# EasyEDA schematic SCH_u2-SX Mini - Slot Board_2024-03-27.json

## Sheets
1 CONN: TITLE: Sheet_1; REV: 1.0; Date: 2024-03-24; Sheet: 1/1; Drawn By: Denjhang; Company: Your Company
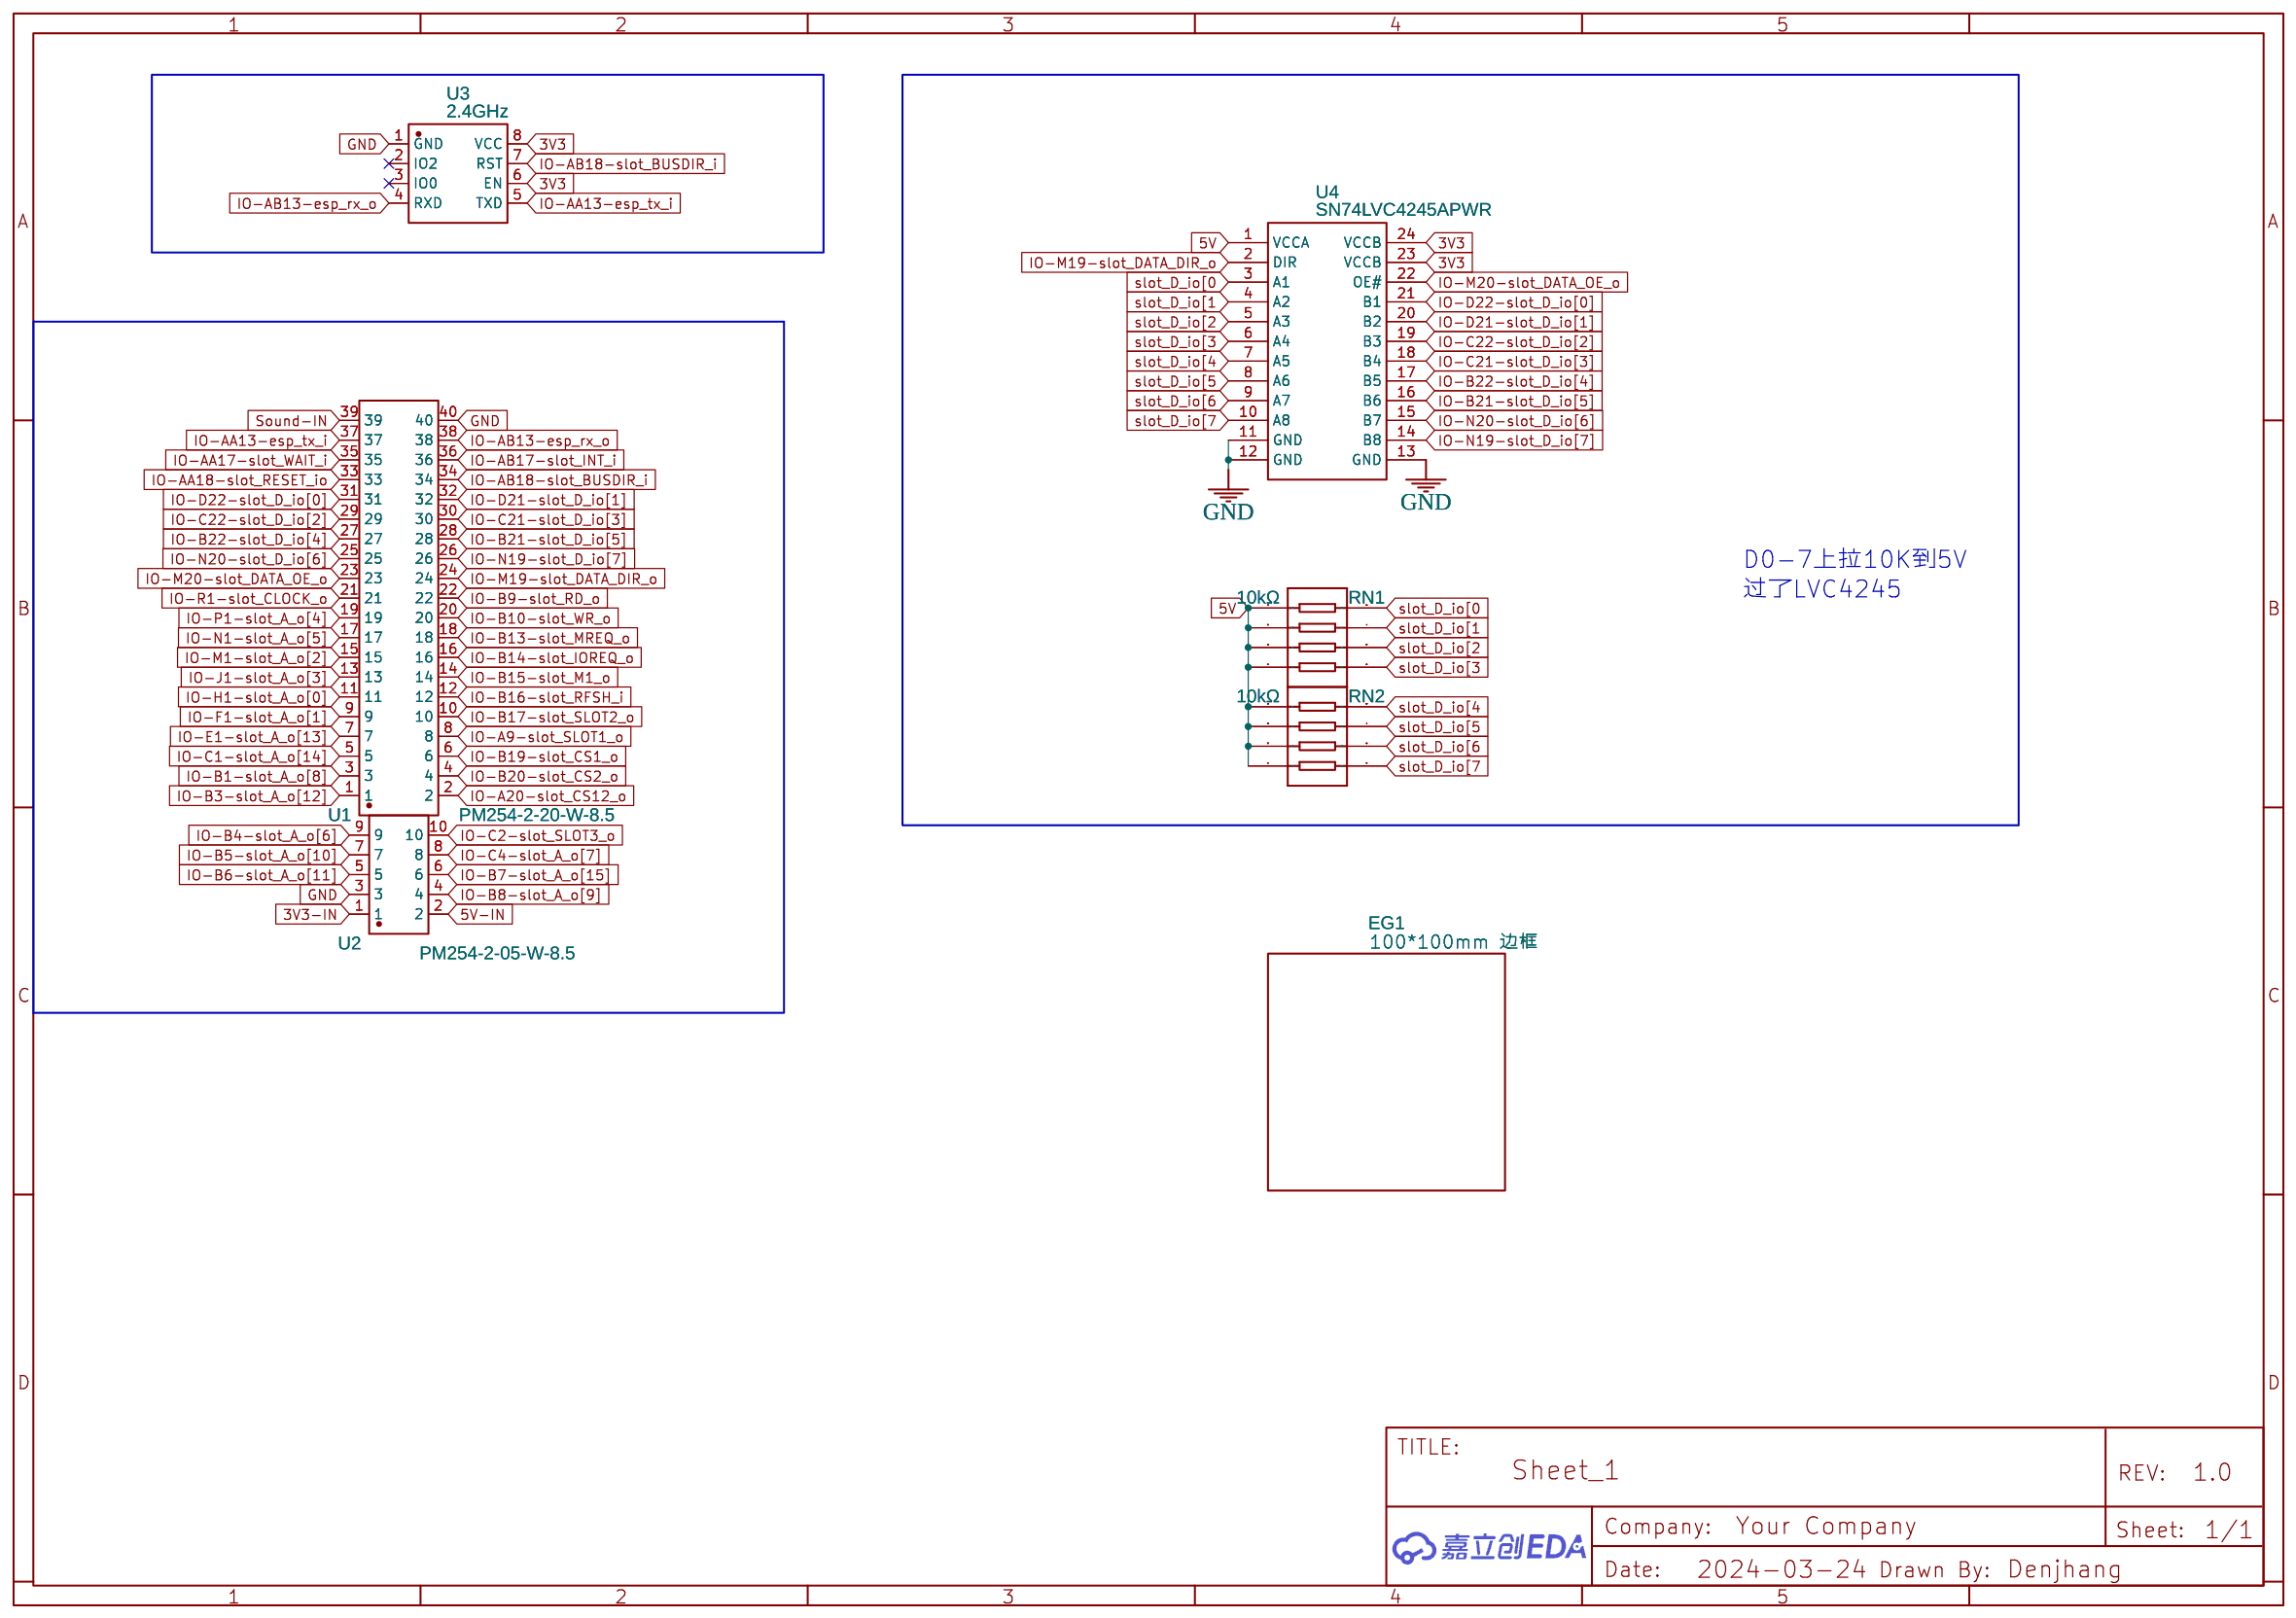
[diagram p0: CONN]
2 SLOT: TITLE: Sheet_2
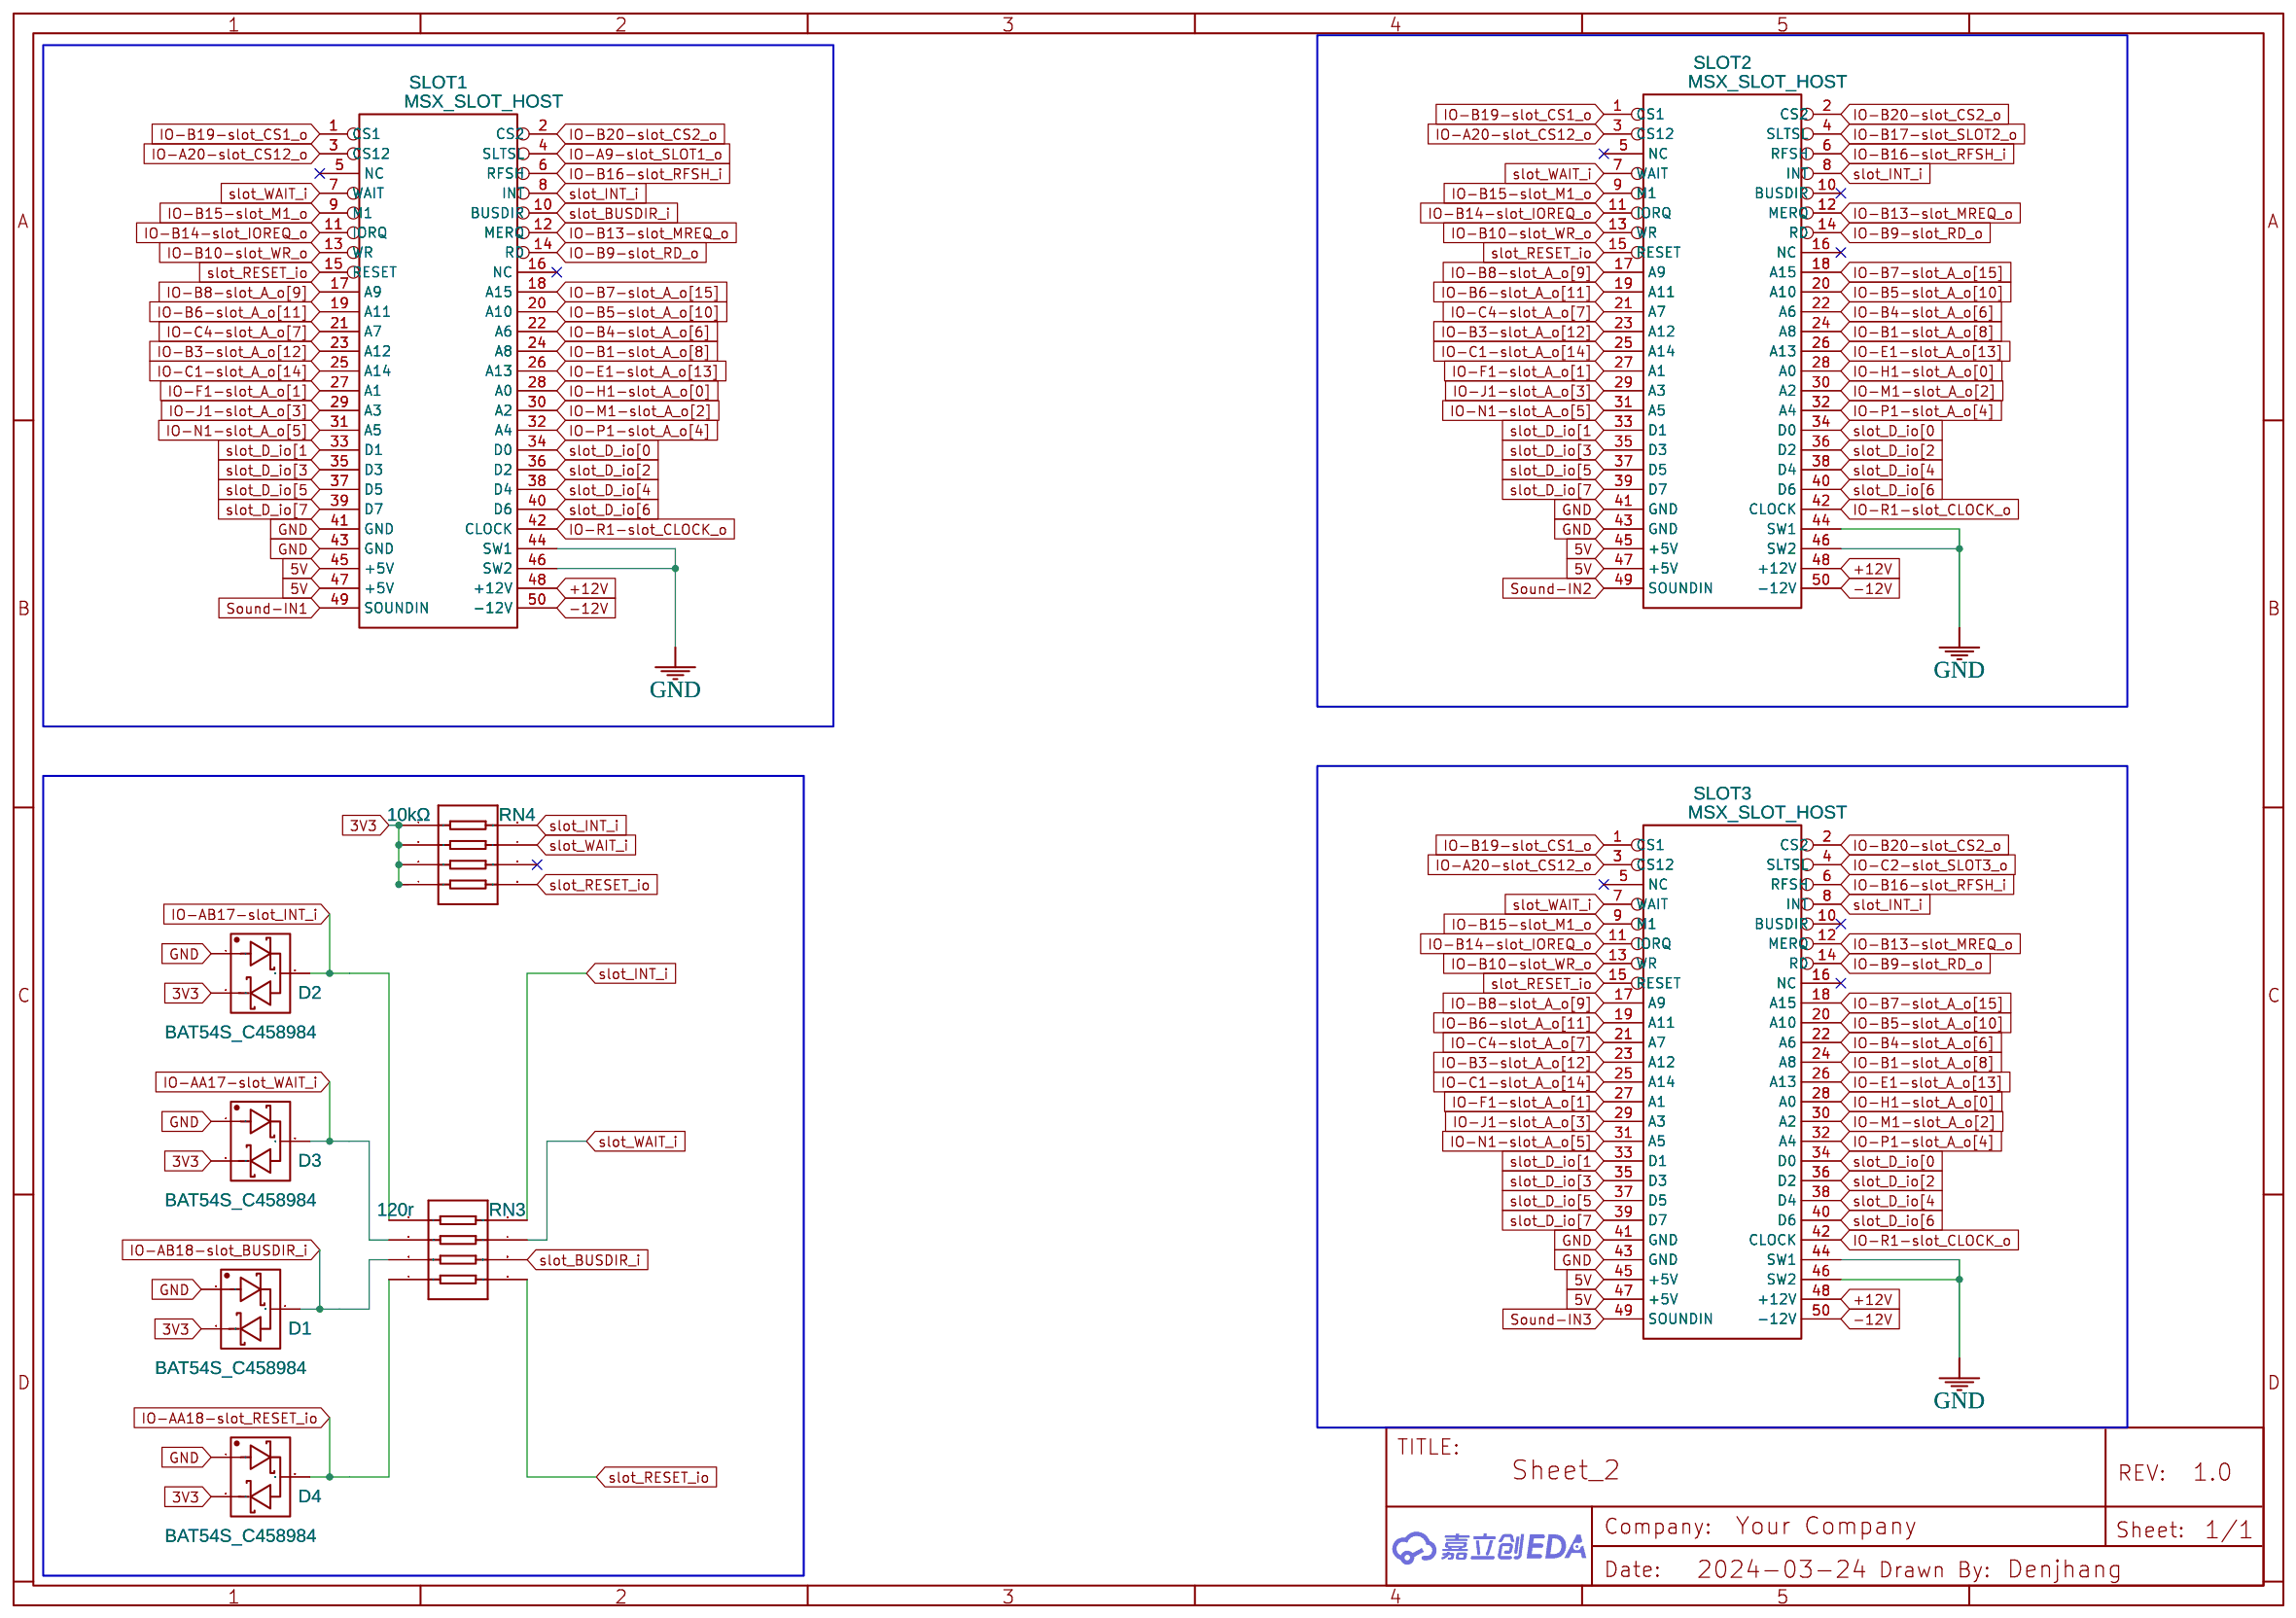
[diagram p1: SLOT]
3 PSU: TITLE: Sheet_2
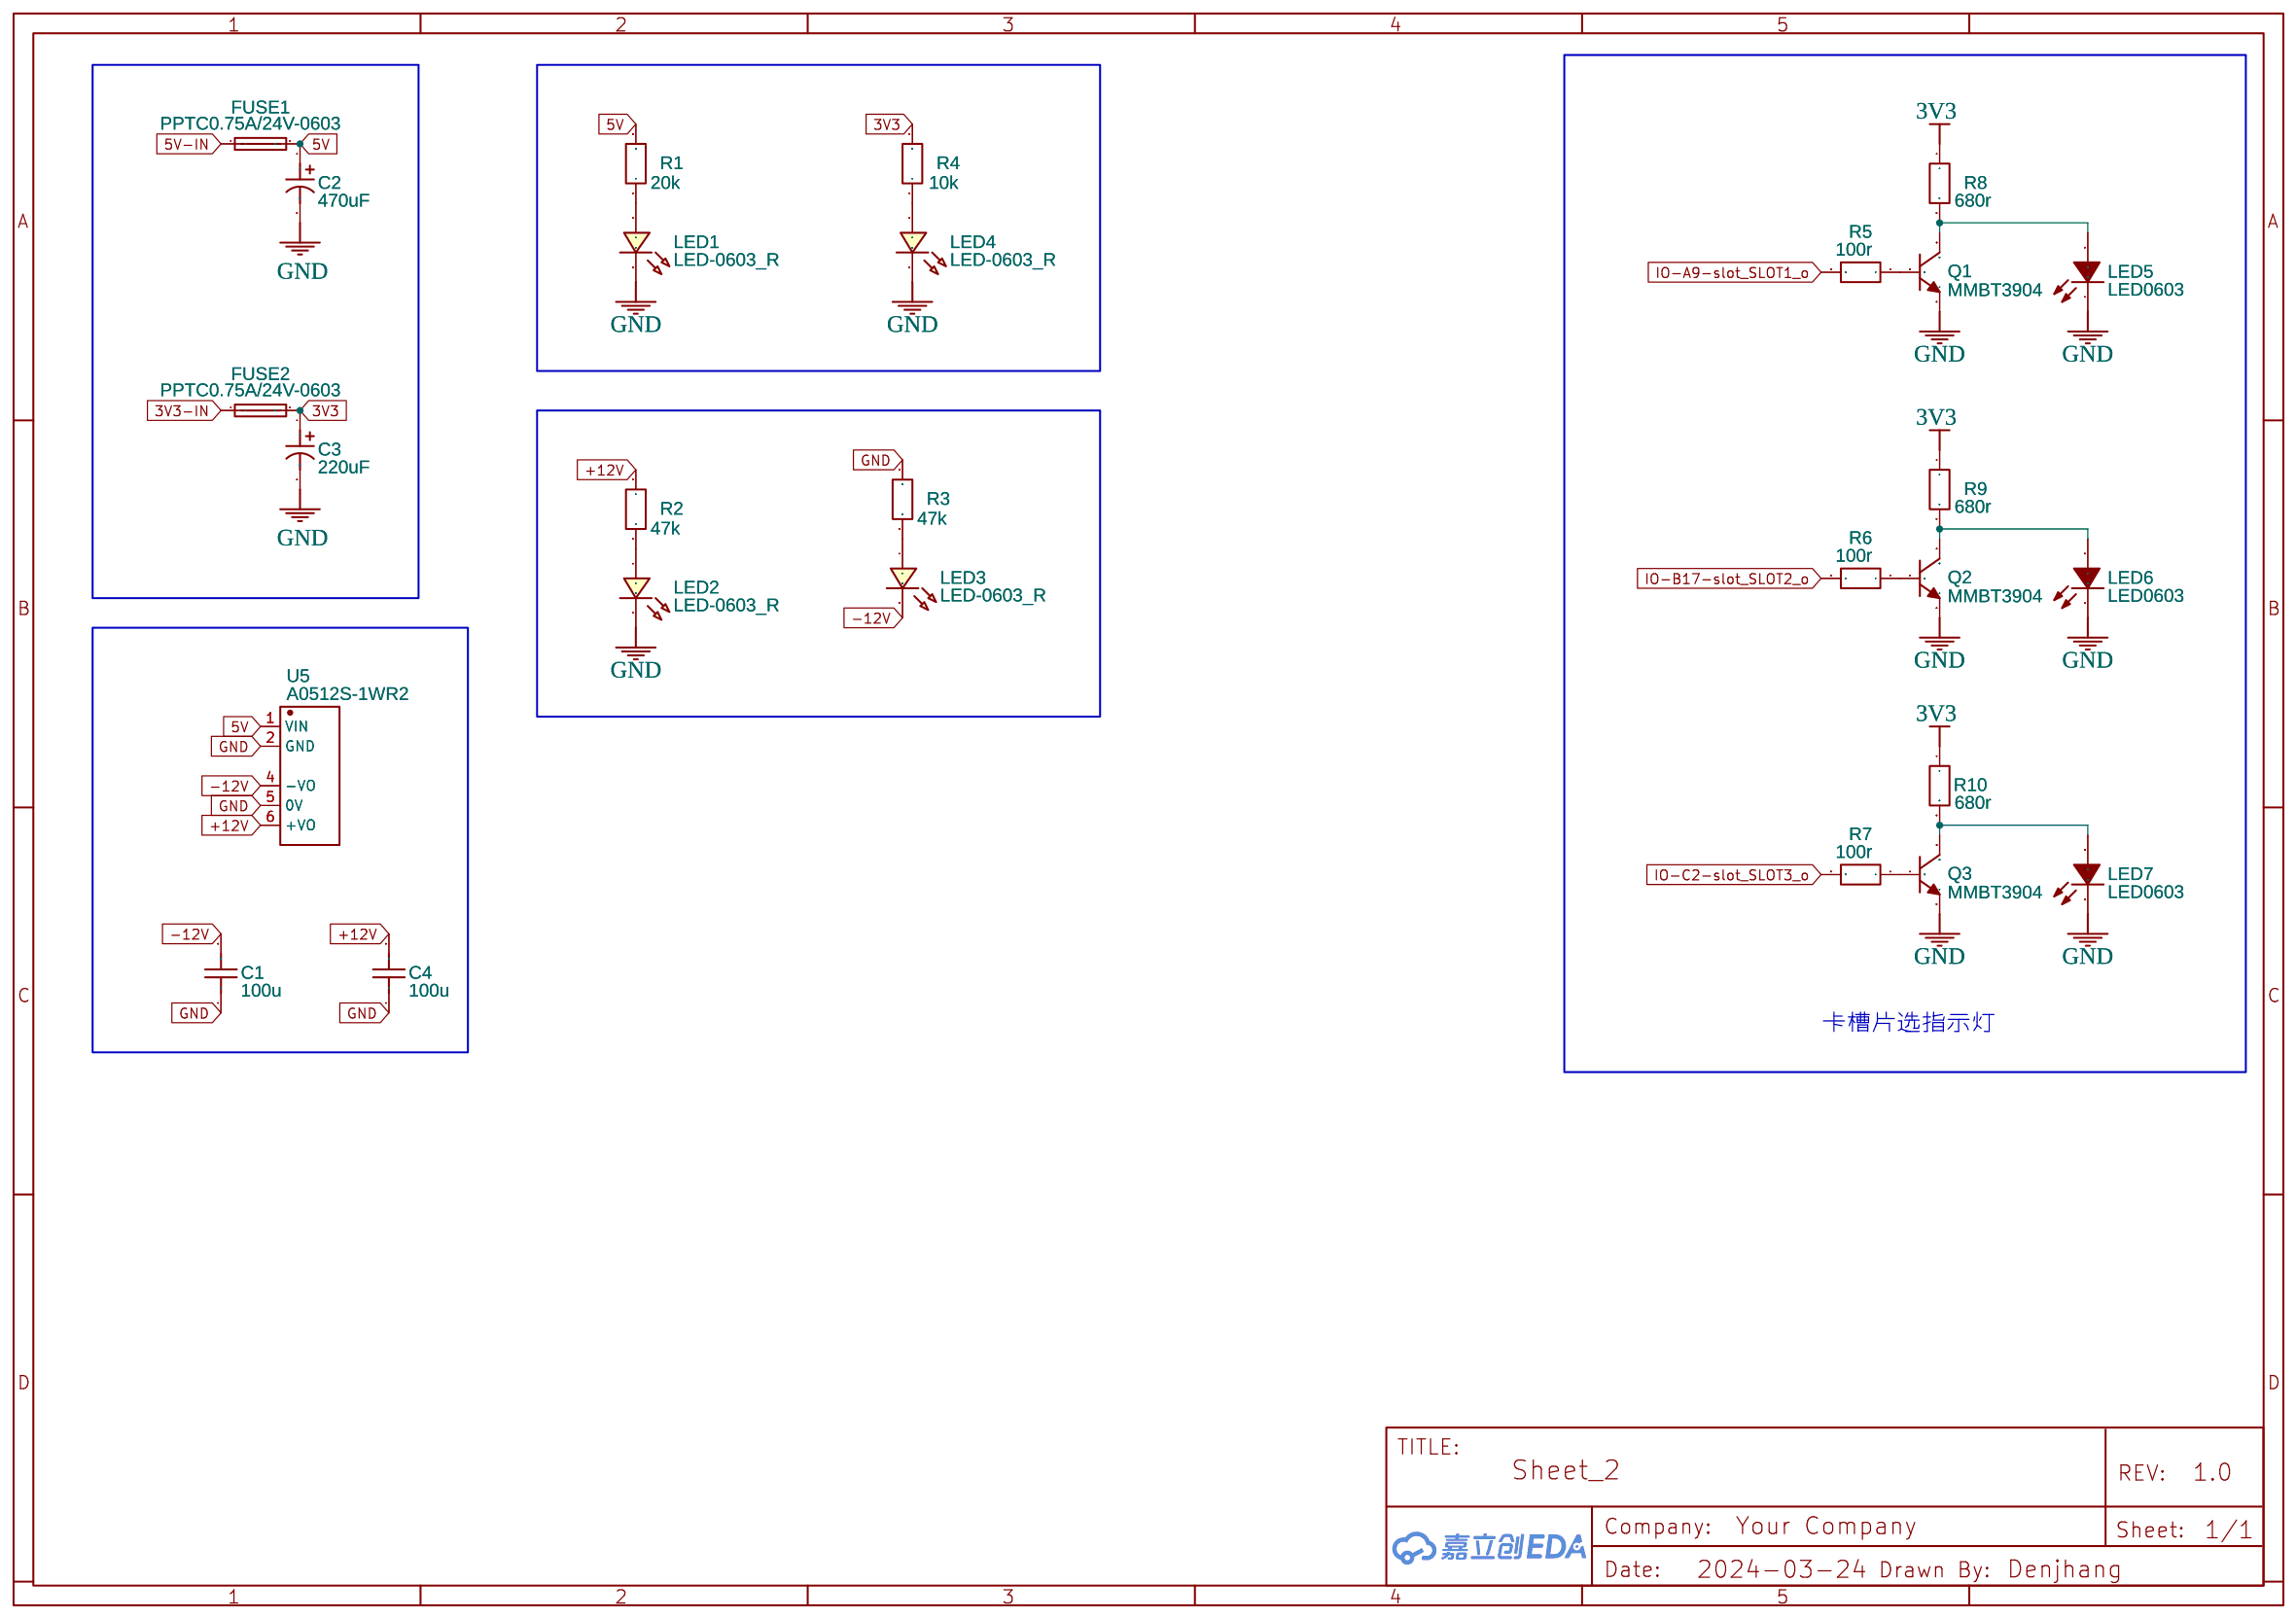
[diagram p2: PSU]
4 AUDIO
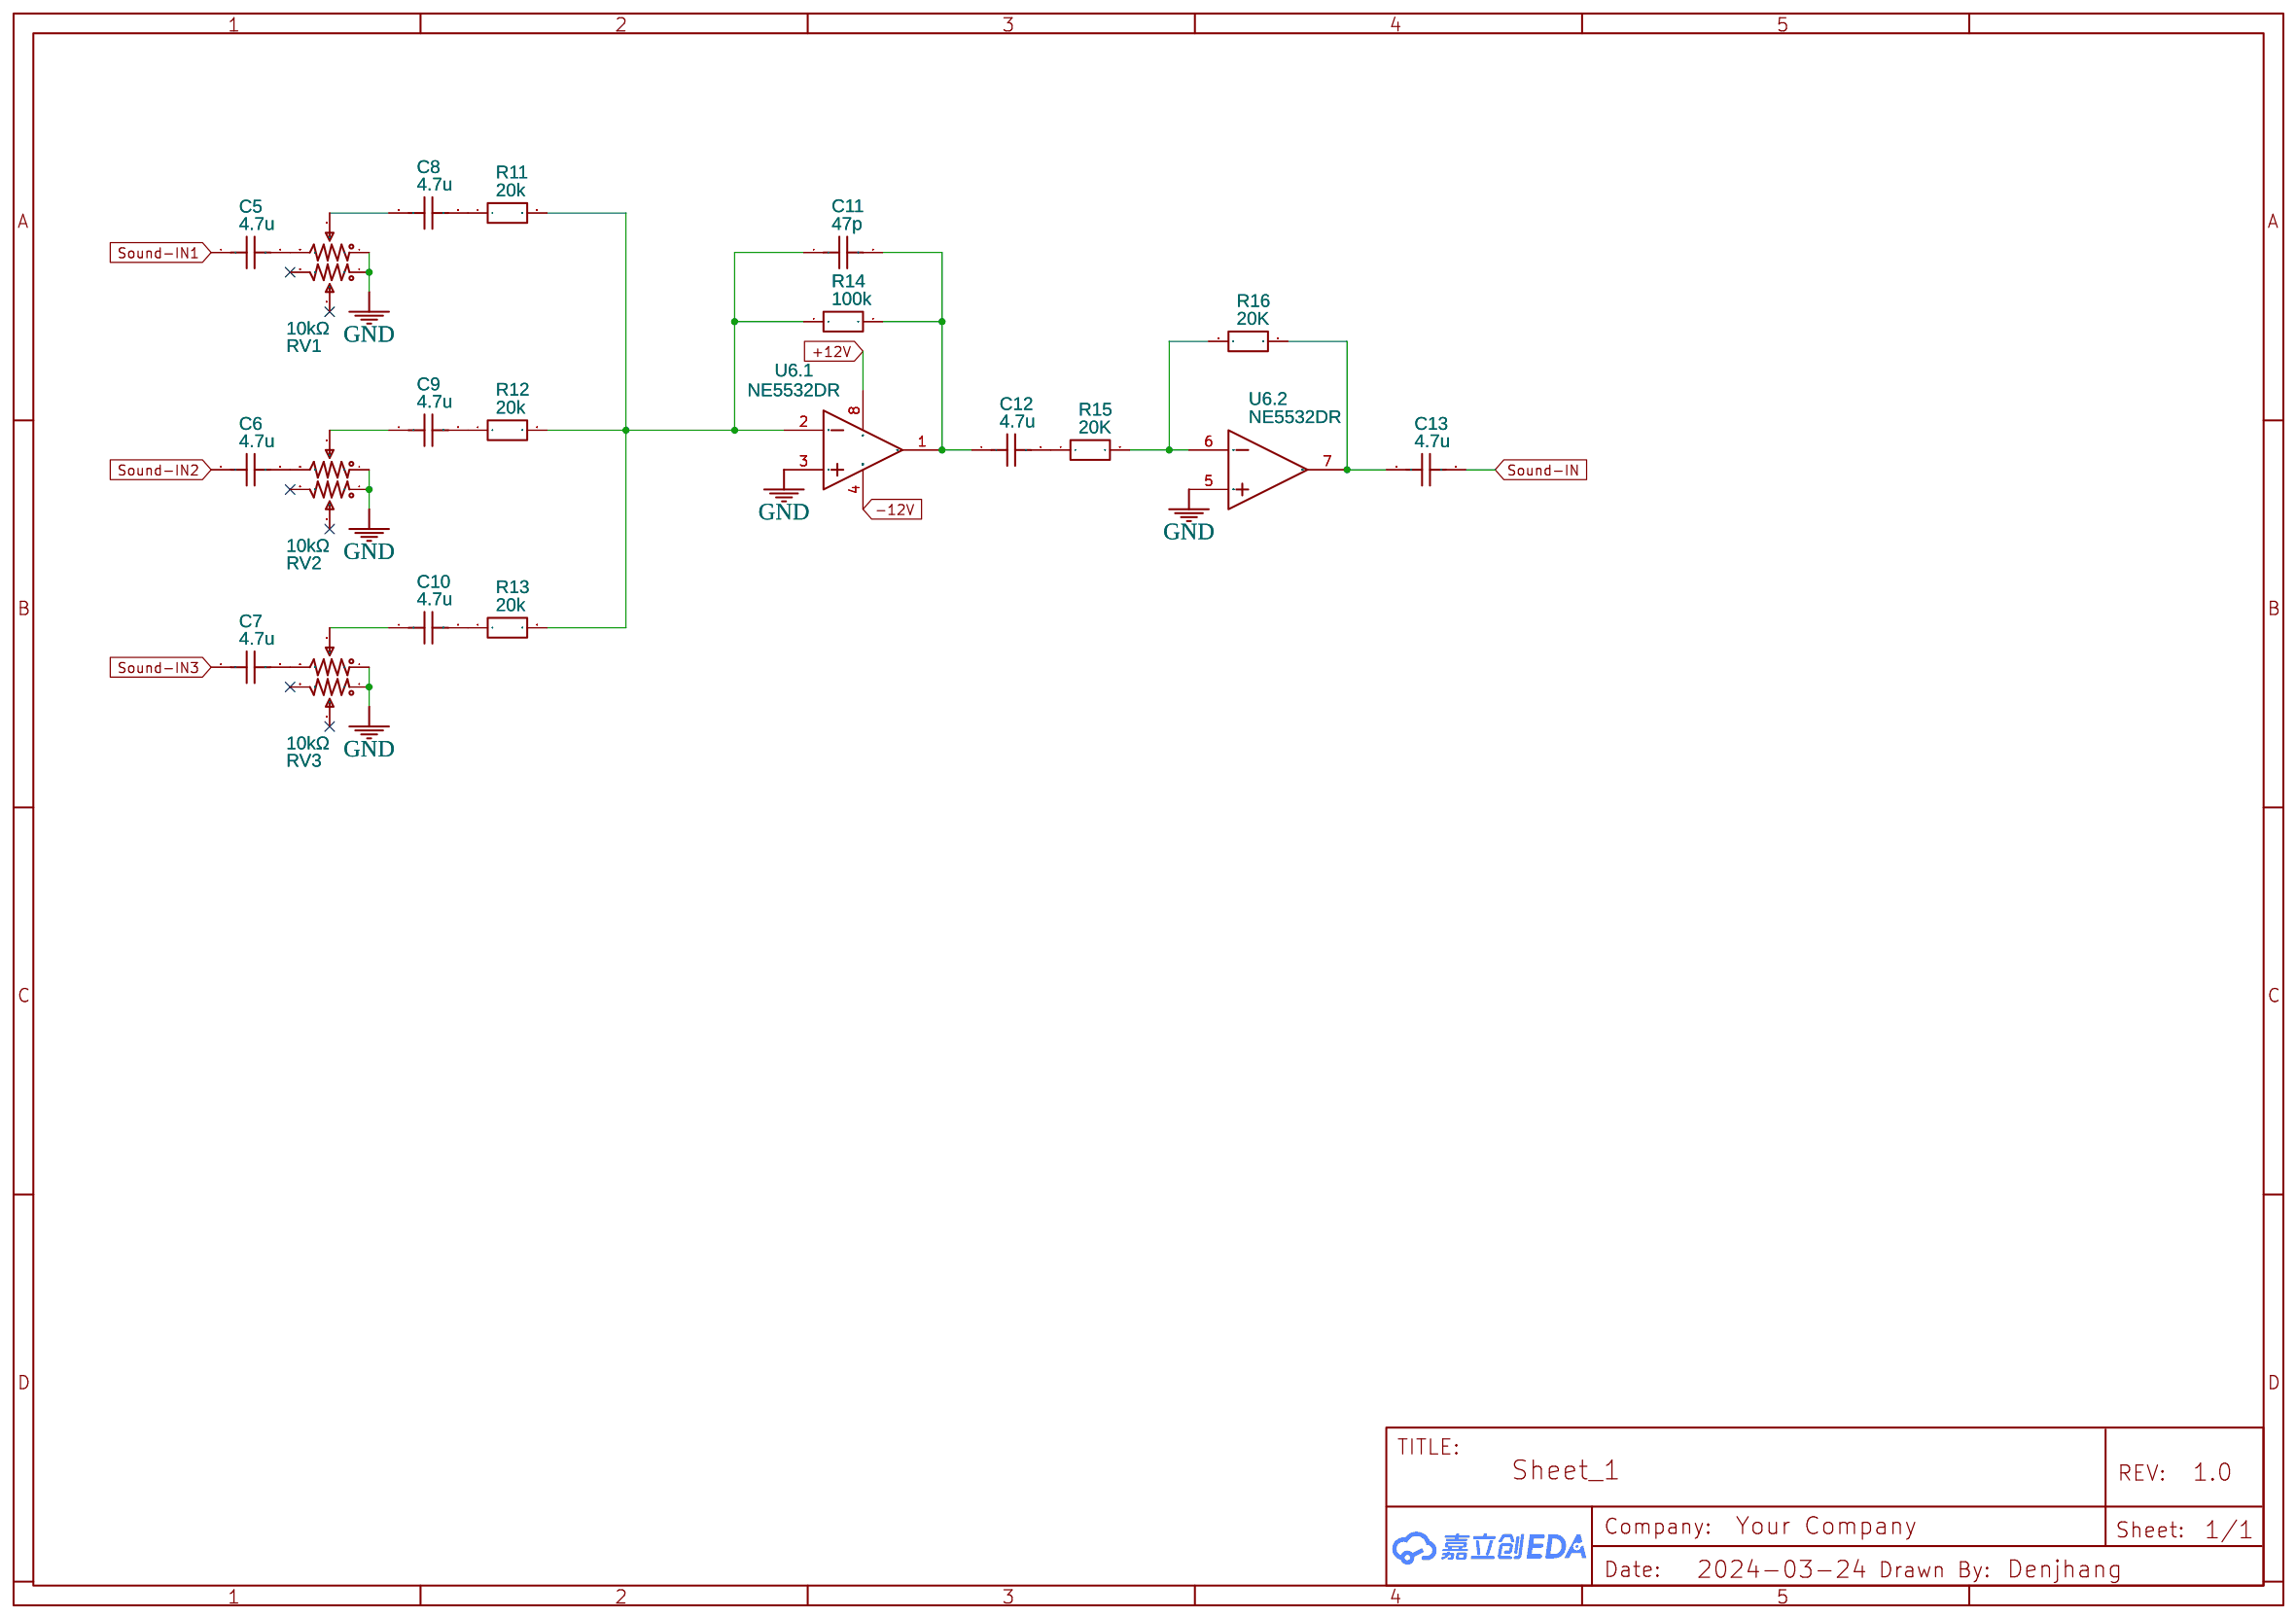
[diagram p3: AUDIO]

## Parts
sheet AUDIO
C5  4.7u  [C0603]
C6  4.7u  [C0603]
C7  4.7u  [C0603]
C8  4.7u  [C0603]
C9  4.7u  [C0603]
C10  4.7u  [C0603]
C11  47p  [C0603]
C12  4.7u  [C0603]
C13  4.7u  [C0603]
R11  20k  [R0603]
R12  20k  [R0603]
R13  20k  [R0603]
R14  100k  [R0603]
R15  20K  [R0603]
R16  20K  [R0603]
RV1  10kΩ  [RK097G-DJ]
RV2  10kΩ  [RK097G-DJ]
RV3  10kΩ  [RK097G-DJ]
U6  NE5532DR  [SOIC-8_L4.9-W3.9-P1.27-LS6.0-BL]  (sections 1,2)
sheet CONN
EG1  100*100mm 边框  [100*100MM 边框]
RN1  10kΩ  [RES-ARRAY-SMD_0603-8P-L3.2-W1.6-BL]
RN2  10kΩ  [RES-ARRAY-SMD_0603-8P-L3.2-W1.6-BL]
U1  PM254-2-20-W-8.5  [HDR-TH_40P-P2.54-H-F-R2-C20-W8.5]
U2  PM254-2-05-W-8.5  [HDR-TH_10P-P2.54-H-F-R2-C5-W8.5]
U3  2.4GHz  [WIFIM-TH_8P-L24.7-W14.4-P2.54]
U4  SN74LVC4245APWR  [TSSOP-24_L7.8-W4.4-P0.65-LS6.4-BL]
sheet PSU
C1  100u  [C1206]
C2  470uF  [CAP-SMD_BD6.3-L6.6-W6.6-FD]
C3  220uF  [CAP-SMD_BD6.3-L6.6-W6.6-FD]
C4  100u  [C1206]
FUSE1  PPTC0.75A/24V-0603  [F0603]
FUSE2  PPTC0.75A/24V-0603  [F0603]
LED1  LED-0603_R  [LED0603_RED]
LED2  LED-0603_R  [LED0603_RED]
LED3  LED-0603_R  [LED0603_RED]
LED4  LED-0603_R  [LED0603_RED]
LED5  LED0603  [LED0603-RD]
LED6  LED0603  [LED0603-RD]
LED7  LED0603  [LED0603-RD]
Q1  MMBT3904  [SOT-23-3_L2.9-W1.3-P1.90-LS2.4-BR]
Q2  MMBT3904  [SOT-23-3_L2.9-W1.3-P1.90-LS2.4-BR]
Q3  MMBT3904  [SOT-23-3_L2.9-W1.3-P1.90-LS2.4-BR]
R1  20k  [R0603]
R2  47k  [R0603]
R3  47k  [R0603]
R4  10k  [R0603]
R5  100r  [R0603]
R6  100r  [R0603]
R7  100r  [R0603]
R8  680r  [R0603]
R9  680r  [R0603]
R10  680r  [R0603]
U5  A0512S-1WR2  [PWRM-TH_A0512S-1WR2]
sheet SLOT
D1  BAT54S_C458984  [SOT-23-3_L2.9-W1.3-P1.90-LS2.4-BR]
D2  BAT54S_C458984  [SOT-23-3_L2.9-W1.3-P1.90-LS2.4-BR]
D3  BAT54S_C458984  [SOT-23-3_L2.9-W1.3-P1.90-LS2.4-BR]
D4  BAT54S_C458984  [SOT-23-3_L2.9-W1.3-P1.90-LS2.4-BR]
RN3  120r  [RES-ARRAY-SMD_0603-8P-L3.2-W1.6-BL]
RN4  10kΩ  [RES-ARRAY-SMD_0603-8P-L3.2-W1.6-BL]
SLOT1  MSX_SLOT_HOST  [MSX_SLOT_HOST]
SLOT2  MSX_SLOT_HOST  [MSX_SLOT_HOST]
SLOT3  MSX_SLOT_HOST  [MSX_SLOT_HOST]

## Library data of the parts
C5-C13 = C_0603_US: Contributor: LCEDA_Lib
R1-R16 = R_0603_EU: Contributor: LCEDA_Lib
RV1-RV3 = RK097-双连体: Contributor: LCSC; Supplier: LCSC; Supplier Part: C231763; Manufacturer: ALPSALPINE(阿尔卑斯阿尔派); Manufacturer Part: RK09712200MY; JLCPCB Part Class: Extended Part
U6 = NE5532DR: image: //image.lceda.cn/szlcsc/C7426.jpg; SMT Type: Basic; subpart_no: 2; Supplier: LCSC; Manufacturer: TI(德州仪器); LCSC Assembly: Yes; Supplier Part: C7426; JLCPCB Part Class: Basic Part; link: https://so.szlcsc.com/global.html?k=C7426&ref=editor
EG1 = 100*100mm 边框: Contributor: Denjhang
RN1-RN4 = RC-ML08W103JT: Contributor: LCSC; Supplier: LCSC; Manufacturer: FH(风华); Supplier Part: C69593; JLCPCB Part Class: Extended Part; link: https://so.szlcsc.com/global.html?k=C69593&ref=editor
U1 = PM254-2-20-W-8.5: Contributor: LCSC; Supplier: LCSC; Supplier Part: C2897440; Manufacturer: HCTL(华灿天禄); JLCPCB Part Class: Extended Part; link: https://so.szlcsc.com/global.html?k=C2897440&ref=editor
U2 = PM254-2-05-W-8.5: Contributor: LCSC; Supplier: LCSC; Supplier Part: C2897425; Manufacturer: HCTL(华灿天禄); JLCPCB Part Class: Extended Part; link: https://so.szlcsc.com/global.html?k=C2897425&ref=editor
U3 = ESP-01: Contributor: LCSC; Supplier: LCSC; Supplier Part: C503581; Manufacturer: Ai-Thinker(安信可); JLCPCB Part Class: Extended Part; link: https://so.szlcsc.com/global.html?k=C503581&ref=editor
U4 = SN74LVC4245APWR: Supplier: LCSC; Manufacturer: TI(德州仪器); Supplier Part: C7859; JLCPCB Part Class: Extended Part; link: https://so.szlcsc.com/global.html?k=C7859&ref=editor
C1 C4 = C_1206_US: Contributor: LCEDA_Lib
C2 C3 = RVT220UF16V67RV0015: Contributor: LCSC; Supplier: LCSC; Supplier Part: C2887273; Manufacturer: KNSCHA(科尼盛); JLCPCB Part Class: Extended Part; link: https://so.szlcsc.com/global.html?k=C2887273&ref=editor
FUSE1 FUSE2 = PPTC0.5A/24V-0603: Contributor: LCSC; Supplier: LCSC; Supplier Part: C9900007586; Manufacturer: null; Manufacturer Part: PPTC0.5A/24V 自恢复保险丝-0603; JLCPCB Part Class: Extended Part
LED1-LED4 = LED-0603_R: Manufacturer: EVERLIGHT(台湾亿光); Manufacturer Part: 19-217/R6C-AL1M2VY/3T; Supplier Part: C72044; Supplier: LCSC; Contributor: LCEDA_01
LED5-LED7 = LED0603: Supplier: LCSC; Supplier Part: C2892154; Manufacturer: GBG; Manufacturer Part: GBG-C192KRKT; link: https://atta.szlcsc.comnull; Contributor: Denjhang
Q1-Q3 = MMBT3904: Supplier: LCSC; Manufacturer: CJ; Supplier Part: C20526; Contributor: Denjhang; JLCPCB Part Class: Basic Part
U5 = A0512S-1WR2: Supplier: LCSC; Manufacturer: MORNSUN(金升阳); Supplier Part: C91768; JLCPCB Part Class: Extended Part; link: https://so.szlcsc.com/global.html?k=C91768&ref=editor
D1-D4 = BAT54S_C458984: Contributor: LCSC; Supplier: LCSC; Supplier Part: C458984; Manufacturer: Slkor(萨科微); Manufacturer Part: BAT54S; JLCPCB Part Class: Extended Part; link: https://so.szlcsc.com/global.html?k=C458984&ref=editor
SLOT1-SLOT3 = MSX_SLOT_HOST: Contributor: denjhang

## Nets
3V3: C3.1 D1.2 D2.2 D3.2 D4.2 FUSE2.2 R4.2 R8.1 R9.1 R10.1 RN4.1 RN4.2 RN4.3 RN4.4 U3.6(EN) U3.8(VCC) U4.23(VCCB) U4.24(VCCB)
3V3-IN: FUSE2.1 U2.1
5V: C2.1 FUSE1.2 R1.2 RN1.1 RN1.2 RN1.3 RN1.4 RN2.1 RN2.2 RN2.3 RN2.4 SLOT1.45(+5V) SLOT1.47(+5V) SLOT2.45(+5V) SLOT2.47(+5V) SLOT3.45(+5V) SLOT3.47(+5V) U4.1(VCCA) U5.1(VIN)
5V-IN: FUSE1.1 U2.2
+12V: C4.2 R2.2 SLOT1.48(+12V) SLOT2.48(+12V) SLOT3.48(+12V) U5.6(+VO) U6.8(VCC+)
-12V: C1.2 LED3.2 SLOT1.50(-12V) SLOT2.50(-12V) SLOT3.50(-12V) U5.4(-VO) U6.4(VCC-/GND)
GND: C1.1 C2.2 C3.2 C4.1 D1.1 D2.1 D3.1 D4.1 LED1.2 LED2.2 LED4.2 LED5.1(C) LED6.1(C) LED7.1(C) Q1.2(E) Q2.2(E) Q3.2(E) R3.2 RV1.1 RV1.4 RV2.1 RV2.4 RV3.1 RV3.4 SLOT1.41(GND) SLOT1.43(GND) SLOT1.44(SW1) SLOT1.46(SW2) SLOT2.41(GND) SLOT2.43(GND) SLOT2.44(SW1) SLOT2.46(SW2) SLOT3.41(GND) SLOT3.43(GND) SLOT3.44(SW1) SLOT3.46(SW2) U1.40 U2.3 U3.1(GND) U4.11(GND) U4.12(GND) U4.13(GND) U5.2(GND) U5.5(0V) U6.3(IN1+) U6.5(IN2+)
IO-A9-slot_SLOT1_o: R5.2 SLOT1.4(SLTSL) U1.8
IO-A20-slot_CS12_o: SLOT1.3(CS12) SLOT2.3(CS12) SLOT3.3(CS12) U1.2
IO-AA13-esp_tx_i: U1.37 U3.5(TXD)
IO-AA17-slot_WAIT_i: D3.3 RN3.2 U1.35
IO-AA18-slot_RESET_io: D4.3 RN3.4 U1.33
IO-AB13-esp_rx_o: U1.38 U3.4(RXD)
IO-AB17-slot_INT_i: D2.3 RN3.1 U1.36
IO-AB18-slot_BUSDIR_i: D1.3 RN3.3 U1.34 U3.7(RST)
IO-B1-slot_A_o[8]: SLOT1.24(A8) SLOT2.24(A8) SLOT3.24(A8) U1.3
IO-B3-slot_A_o[12]: SLOT1.23(A12) SLOT2.23(A12) SLOT3.23(A12) U1.1
IO-B4-slot_A_o[6]: SLOT1.22(A6) SLOT2.22(A6) SLOT3.22(A6) U2.9
IO-B5-slot_A_o[10]: SLOT1.20(A10) SLOT2.20(A10) SLOT3.20(A10) U2.7
IO-B6-slot_A_o[11]: SLOT1.19(A11) SLOT2.19(A11) SLOT3.19(A11) U2.5
IO-B7-slot_A_o[15]: SLOT1.18(A15) SLOT2.18(A15) SLOT3.18(A15) U2.6
IO-B8-slot_A_o[9]: SLOT1.17(A9) SLOT2.17(A9) SLOT3.17(A9) U2.4
IO-B9-slot_RD_o: SLOT1.14(RD) SLOT2.14(RD) SLOT3.14(RD) U1.22
IO-B10-slot_WR_o: SLOT1.13(WR) SLOT2.13(WR) SLOT3.13(WR) U1.20
IO-B13-slot_MREQ_o: SLOT1.12(MERQ) SLOT2.12(MERQ) SLOT3.12(MERQ) U1.18
IO-B14-slot_IOREQ_o: SLOT1.11(IORQ) SLOT2.11(IORQ) SLOT3.11(IORQ) U1.16
IO-B15-slot_M1_o: SLOT1.9(M1) SLOT2.9(M1) SLOT3.9(M1) U1.14
IO-B16-slot_RFSH_i: SLOT1.6(RFSH) SLOT2.6(RFSH) SLOT3.6(RFSH) U1.12
IO-B17-slot_SLOT2_o: R6.2 SLOT2.4(SLTSL) U1.10
IO-B19-slot_CS1_o: SLOT1.1(CS1) SLOT2.1(CS1) SLOT3.1(CS1) U1.6
IO-B20-slot_CS2_o: SLOT1.2(CS2) SLOT2.2(CS2) SLOT3.2(CS2) U1.4
IO-B21-slot_D_io[5]: U1.28 U4.16(B6)
IO-B22-slot_D_io[4]: U1.27 U4.17(B5)
IO-C1-slot_A_o[14]: SLOT1.25(A14) SLOT2.25(A14) SLOT3.25(A14) U1.5
IO-C2-slot_SLOT3_o: R7.2 SLOT3.4(SLTSL) U2.10
IO-C4-slot_A_o[7]: SLOT1.21(A7) SLOT2.21(A7) SLOT3.21(A7) U2.8
IO-C21-slot_D_io[3]: U1.30 U4.18(B4)
IO-C22-slot_D_io[2]: U1.29 U4.19(B3)
IO-D21-slot_D_io[1]: U1.32 U4.20(B2)
IO-D22-slot_D_io[0]: U1.31 U4.21(B1)
IO-E1-slot_A_o[13]: SLOT1.26(A13) SLOT2.26(A13) SLOT3.26(A13) U1.7
IO-F1-slot_A_o[1]: SLOT1.27(A1) SLOT2.27(A1) SLOT3.27(A1) U1.9
IO-H1-slot_A_o[0]: SLOT1.28(A0) SLOT2.28(A0) SLOT3.28(A0) U1.11
IO-J1-slot_A_o[3]: SLOT1.29(A3) SLOT2.29(A3) SLOT3.29(A3) U1.13
IO-M1-slot_A_o[2]: SLOT1.30(A2) SLOT2.30(A2) SLOT3.30(A2) U1.15
IO-M19-slot_DATA_DIR_o: U1.24 U4.2(DIR)
IO-M20-slot_DATA_OE_o: U1.23 U4.22(OE#)
IO-N1-slot_A_o[5]: SLOT1.31(A5) SLOT2.31(A5) SLOT3.31(A5) U1.17
IO-N19-slot_D_io[7]: U1.26 U4.14(B8)
IO-N20-slot_D_io[6]: U1.25 U4.15(B7)
IO-P1-slot_A_o[4]: SLOT1.32(A4) SLOT2.32(A4) SLOT3.32(A4) U1.19
IO-R1-slot_CLOCK_o: SLOT1.42(CLOCK) SLOT2.42(CLOCK) SLOT3.42(CLOCK) U1.21
slot_BUSDIR_i: RN3.6 SLOT1.10(BUSDIR)
slot_D_io[0: RN1.8 SLOT1.34(D0) SLOT2.34(D0) SLOT3.34(D0) U4.3(A1)
slot_D_io[1: RN1.7 SLOT1.33(D1) SLOT2.33(D1) SLOT3.33(D1) U4.4(A2)
slot_D_io[2: RN1.6 SLOT1.36(D2) SLOT2.36(D2) SLOT3.36(D2) U4.5(A3)
slot_D_io[3: RN1.5 SLOT1.35(D3) SLOT2.35(D3) SLOT3.35(D3) U4.6(A4)
slot_D_io[4: RN2.8 SLOT1.38(D4) SLOT2.38(D4) SLOT3.38(D4) U4.7(A5)
slot_D_io[5: RN2.7 SLOT1.37(D5) SLOT2.37(D5) SLOT3.37(D5) U4.8(A6)
slot_D_io[6: RN2.6 SLOT1.40(D6) SLOT2.40(D6) SLOT3.40(D6) U4.9(A7)
slot_D_io[7: RN2.5 SLOT1.39(D7) SLOT2.39(D7) SLOT3.39(D7) U4.10(A8)
slot_INT_i: RN3.8 RN4.8 SLOT1.8(INT) SLOT2.8(INT) SLOT3.8(INT)
slot_RESET_io: RN3.5 RN4.5 SLOT1.15(RESET) SLOT2.15(RESET) SLOT3.15(RESET)
slot_WAIT_i: RN3.7 RN4.7 SLOT1.7(WAIT) SLOT2.7(WAIT) SLOT3.7(WAIT)
Sound-IN: C13.2 U1.39
Sound-IN1: C5.1 SLOT1.49(SOUNDIN)
Sound-IN2: C6.1 SLOT2.49(SOUNDIN)
Sound-IN3: C7.1 SLOT3.49(SOUNDIN)
Net-(C5-2): C5.2 RV1.6
Net-(C6-2): C6.2 RV2.6
Net-(C7-2): C7.2 RV3.6
Net-(C8-1): C8.1 RV1.5
Net-(C8-2): C8.2 R11.1
Net-(C9-1): C9.1 RV2.5
Net-(C9-2): C9.2 R12.1
Net-(C10-1): C10.1 RV3.5
Net-(C10-2): C10.2 R13.1
Net-(C11-1): C11.1 R11.2 R12.2 R13.2 R14.1 U6.2(IN1-)
Net-(C11-2): C11.2 C12.1 R14.2 U6.1(OUT1)
Net-(C12-2): C12.2 R15.1
Net-(C13-1): C13.1 R16.2 U6.7(OUT2)
Net-(LED1-1): LED1.1 R1.1
Net-(LED2-1): LED2.1 R2.1
Net-(LED3-1): LED3.1 R3.1
Net-(LED4-1): LED4.1 R4.1
Net-(LED5-2): LED5.2(A) Q1.3(C) R8.2
Net-(LED6-2): LED6.2(A) Q2.3(C) R9.2
Net-(LED7-2): LED7.2(A) Q3.3(C) R10.2
Net-(Q1-1): Q1.1(B) R5.1
Net-(Q2-1): Q2.1(B) R6.1
Net-(Q3-1): Q3.1(B) R7.1
Net-(R15-2): R15.2 R16.1 U6.6(IN2-)

Not connected (* = marked no-connect by the designer): RN4 6*; RV1 2* 3*; RV2 2* 3*; RV3 2* 3*; SLOT1 5(NC)* 16(NC)*; SLOT2 5(NC)* 10(BUSDIR)* 16(NC)*; SLOT3 5(NC)* 10(BUSDIR)* 16(NC)*; U3 2(IO2)* 3(IO0)*

## Notes on the sheets
sheet 1
- D0-7上拉10K到5V
- 过了LVC4245
sheet 3
- 卡槽片选指示灯
